# Altium schematic sheet headers.SchDoc
size A; SheetNumber: 2; SheetTotal: 3
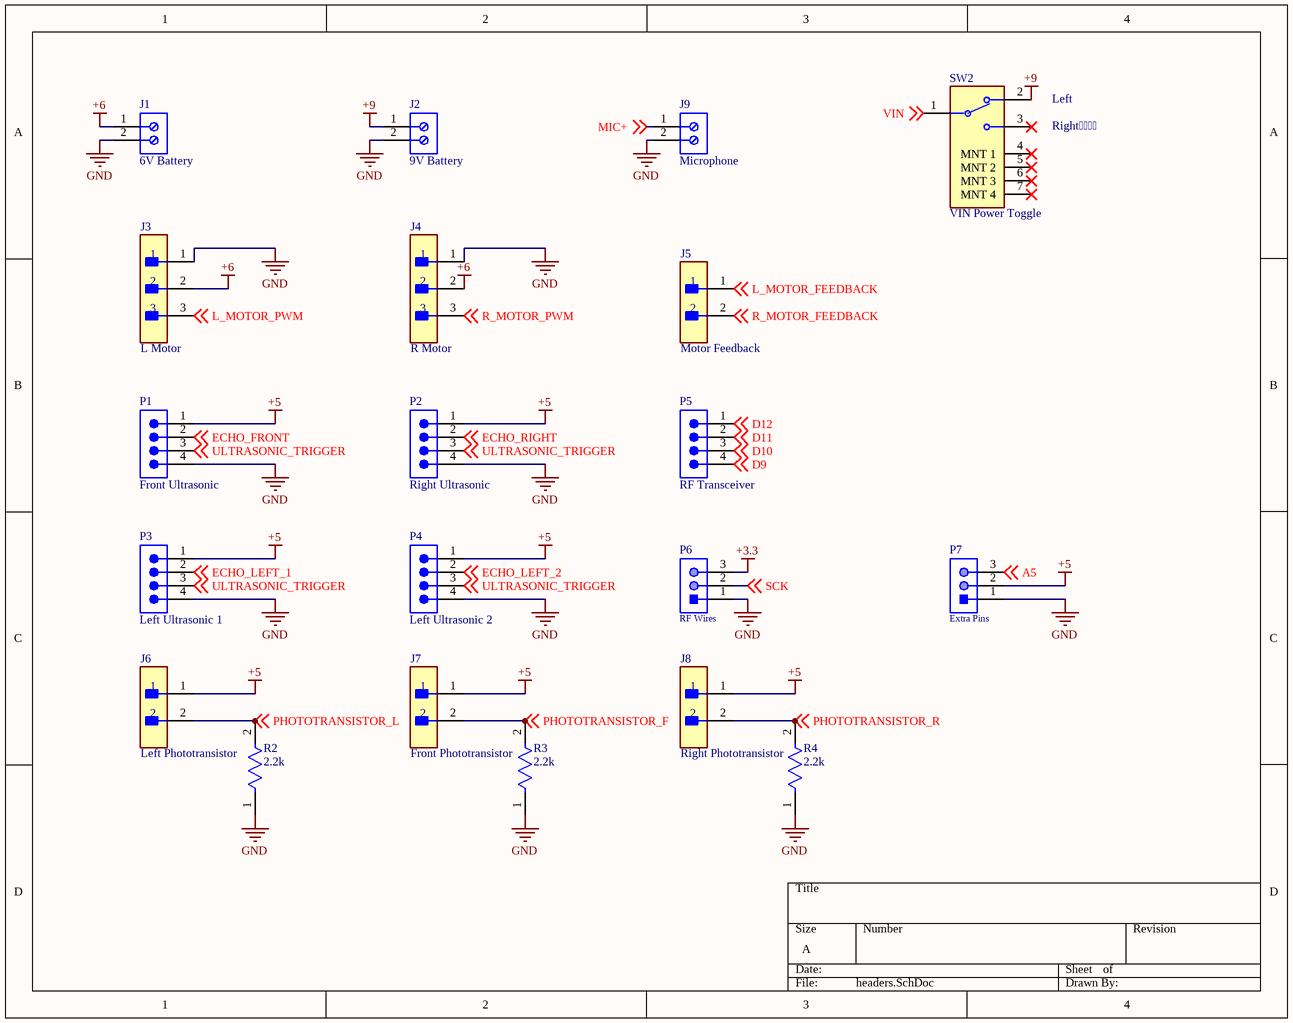
[diagram p0: headers.SchDoc]

## Parts
J1  6V Battery  [691103110002]
J2  9V Battery  [691103110002]
J3  L Motor  [FP-5-104935-3-MFG]
J4  R Motor  [FP-5-104935-3-MFG]
J5  Motor Feedback  [FP-M20-9990246-MFG]
J6  Left Phototransistor  [FP-M20-9990246-MFG]
J7  Front Phototransistor  [FP-M20-9990246-MFG]
J8  Right Phototransistor  [FP-M20-9990246-MFG]
J9  Microphone  [691103110002]
P1  Front Ultrasonic  [SMTC-TSW-104-08-X-S]
P2  Right Ultrasonic  [SMTC-TSW-104-08-X-S]
P3  Left Ultrasonic 1  [SMTC-TSW-104-08-X-S]
P4  Left Ultrasonic 2  [SMTC-TSW-104-08-X-S]
P5  RF Transceiver  [SMTC-TSW-104-08-X-S]
P6  RF Wires  [61300311121]
P7  Extra Pins  [61300311121]
R2  2.2k  [FP-CRCW0805-e3-IPC_B]
R3  2.2k  [FP-CRCW0805-e3-IPC_B]
R4  2.2k  [FP-CRCW0805-e3-IPC_B]
SW2  VIN Power Toggle  [FP-PCM12SMTR-MFG]

## Nets
+3.3: P6.3
+5: J6.1 J7.1 J8.1 P1.1 P2.1 P3.1 P4.1 P7.2
+6: J1.1 J3.2 J4.2
+9: J2.1 SW2.2
GND: J1.2 J2.2 J3.1 J4.1 J9.2 P1.4 P2.4 P3.4 P4.4 P6.1 P7.1 R2.1 R3.1 R4.1
A5: P7.3 ; off-sheet A5
D9: P5.4 ; off-sheet D9
D10: P5.3 ; off-sheet D10
D11: P5.2 ; off-sheet D11
D12: P5.1 ; off-sheet D12
ECHO_FRONT: P1.2 ; off-sheet ECHO_FRONT
ECHO_LEFT_1: P3.2 ; off-sheet ECHO_LEFT_1
ECHO_LEFT_2: P4.2 ; off-sheet ECHO_LEFT_2
ECHO_RIGHT: P2.2 ; off-sheet ECHO_RIGHT
L_MOTOR_FEEDBACK: J5.1 ; off-sheet L_MOTOR_FEEDBACK
L_MOTOR_PWM: J3.3 ; off-sheet L_MOTOR_PWM
MIC+: J9.1 ; off-sheet MIC+
PHOTOTRANSISTOR_F: J7.2 R3.2 ; off-sheet PHOTOTRANSISTOR_F
PHOTOTRANSISTOR_L: J6.2 R2.2 ; off-sheet PHOTOTRANSISTOR_L
PHOTOTRANSISTOR_R: J8.2 R4.2 ; off-sheet PHOTOTRANSISTOR_R
R_MOTOR_FEEDBACK: J5.2 ; off-sheet R_MOTOR_FEEDBACK
R_MOTOR_PWM: J4.3 ; off-sheet R_MOTOR_PWM
SCK: P6.2 ; off-sheet SCK
ULTRASONIC_TRIGGER: P1.3 P2.3 P3.3 P4.3 ; off-sheet ULTRASONIC_TRIGGER
VIN: SW2.1 ; off-sheet VIN

Not connected (* = marked no-connect by the designer): SW2 3* 4(MNT_1)* 5(MNT_2)* 6(MNT_3)* 7(MNT_4)*

## Notes on the sheet
- (near SW2) Left
- (near SW2) Right

## Library data of the parts
J1 J2 J9 = CMP-1502-03254-1: Series 1031 - 3.50 mm Horizontal Entry Modular with Pressure Clamp WR-TBL, 2 pin; Manufacturer: Wurth Elektronik; Pin Number: 2; Pitch: 3.50mm; Datasheet URL: http://katalog.we-online.de/em/datasheet/6911031100xx.pdf; Package Reference: 691103110002; Publisher: WurthElektronik; Manufacturer URL: http://www.we-online.de; Mounting Technology: THT; Operating Temperature: -40to105degC; Part Number: 691103110002; Packaging: Box; MPN: 691103110002
J3 J4 = CMP-03369-000121-1: CONN HEADER R/A 3POS 2.54MM; MPN: 5-104935-3; Gender: Male; Contact Retention: Yes (With); Number of Contacts: 3; Max Voltage Rating (AC): 30V; Approvals: CSA; PCB Mount Alignment: No (Without); Tail Length: 3.3mm; Row Spacing: 0.1inch; PCB Thickness: 0.062inch; Insulation Resistance: 5GR; Current Rating: 3A; PCB Mount Retention: Without; Contact Resistance: 15mR; PCB Mounting Orientation: Right Angle; Connector Type: Plug; Orientation: Right Angle; Termination: Crimp; Mating Retention: Yes (With); Housing Material: Thermoplastic; Contact Mating Length: 0.23inch; Contact Gender: Male; Number of Rows: 1; Contact Material: Brass; Packaging: Rail/Tube; Flammability Rating: UL94 V-0; Contact Plating: Gold; Radiation Hardening: No; Contact Current Rating: 3A; RoHS Compliant: Yes; Height: 13.59mm; ELV: Compliant; Mount: Through Hole; Color: Black; Contact Type: Male Pin; Length: 0.4inch; Mating Alignment: Yes (With); Strain Relief: No (Without); Pitch: 2.54mm; Backwall/Post Interruptions: No (Without); Housing Color: Black; Contact Shape: Square; Depth: 13.59mm; Min Operating Temperature: -65°C; Series: AMPMODU MTE; Max Operating Temperature: 105°C; Number of Positions: 3; Lead Free: Lead Free; Package Quantity: 52
J5 = CMP-15831-000009-1: CONN HEADER VERT 2POS 2.54MM; Manufacturer: Harwin; Manufacturer Part Number: M20-9990246; Conn Gender: Male; Conn Orientation: Vertical; Number Of Contacts: 2; Current Rating: 3A; ComponentLink2URL: https://cdn.harwin.com/pdfs/M20-999.pdf; ComponentLink2Description: Datasheet; Package: M20-9990246; Temperature: -40°C to +105°C; Octopart: https://octopart.com/m20-9990246-harwin-2590635; Mouser Description: 2.54mm (0.1") Pitch SIL Vertical PC Tail Pin Header, 6.1mm mating pin height, tin, 2 contacts; Temperature Range High: +105°C; Device Class L1: Connectors; RoHS: TRUE; Automotive: No; Height: 8.99mm; Number Of Rows: 1; Contact Material: Tin,Nickel; Category: Conn; Pitch: 2.54mm; Lead Free: Yes; Digikey Description: CONN HEADER VERT 2POS 2.54MM; Temperature Range Low: -40°C; Device Class L3: unset; Device Class L2: Headers and Wire Housings
J6-J8 = CMP-15831-000009-1: CONN HEADER VERT 2POS 2.54MM; Manufacturer: Harwin; Manufacturer Part Number: M20-9990246; Conn Gender: Male; Description: Connector Header Through Hole 2 position 0.100" (2.54mm); Conn Orientation: Vertical; Number Of Contacts: 2; Current Rating: 3A; ComponentLink2URL: https://cdn.harwin.com/pdfs/M20-999.pdf; ComponentLink2Description: Datasheet; Package: M20-9990246; Temperature: -40°C to +105°C; Octopart: https://octopart.com/m20-9990246-harwin-2590635; Mouser Description: 2.54mm (0.1") Pitch SIL Vertical PC Tail Pin Header, 6.1mm mating pin height, tin, 2 contacts; Temperature Range High: +105°C; Device Class L1: Connectors; RoHS: TRUE; Automotive: No; Height: 8.99mm; Number Of Rows: 1; Contact Material: Tin,Nickel; Category: Conn; Pitch: 2.54mm; Lead Free: Yes; Digikey Description: CONN HEADER VERT 2POS 2.54MM; Temperature Range Low: -40°C; Device Class L3: unset; Device Class L2: Headers and Wire Housings
P1-P5 = CMP-1024-00355-1: 0.025" SQ Post Header, Through-hole, Vertical, -55 to 125 degC, 2.54 mm Pitch, 4-Pin, Male, RoHS; Manufacturer: Samtec; PartNumber: TSW-104-08-F-S; Pitch: 2.54 mm; Temperature Range: -55 to 125 degC; ComponentLink3URL: http://www.samtec.com/documents/webfiles/cpdf/TSW-XXX-XX-XXX-X-XX-XXX-MKT.pdf; ComponentLink1Description: Manufacturer URL; PackageReference: TSW-104-08-X-S; DatasheetVersion: F-214; Mounting Technology: Through-hole; ComponentLink3Description: Package Specification; PackageVersion: DM, 8/1988; ComponentLink2Description: Datasheet; ComponentLink1URL: http://www.samtec.com; Orientation: Vertical; ComponentLink2URL: http://www.samtec.com/documents/webfiles/pdf/TSW_TH.PDF; RoHS: True; PackageDescription: .025[0.64] SQ. Post Terminal Strip Assembly
P6 P7 = CMP-1502-01062-1: THT Vertical Pin Header WR-PHD, Pitch 2.54 mm, Single Row, 3 pins; Manufacturer: Wurth Elektronik; Withstanding Voltage: 500VAC; Working Voltage: 250VAC; Rated Current: 3A; Pitch: 2.54mm; Pin Number: 3; Gender: Male; Contact Resistance: 20mOhm; Package Reference: 61300311121; Manufacturer URL: http://www.we-online.de; Datasheet URL: https://katalog.we-online.de/em/datasheet/6130xx11121.pdf; Operating Temperature: -40to105degC; Part Number: 61300311121; Orientation: Vertical; Packaging: Bag; Row Number: Single; Mounting Technology: THT; Publisher: WurthElektronik
R2-R4 = CMP-2001-03760-2: RES Thick Film, 2.2kΩ, 1%, 0.125W, 100ppm/°C, 0805; MPN: CRCW08052K20FKEA; Voltage Rating (DC): 150V; Max Power Dissipation: 125mW; Resistance: 2.2kR; Case/Package: 0805; Width: 1.25mm; Voltage Rating: 150V; Composition: Thick Film; Power Rating: 125mW; Packaging: Tape and Reel; Min Operating Temperature: -55°C; Contact Plating: Tin; Tolerance: 1%; Military Standard: Not; Case Code (Metric): 2012; Radiation Hardening: No; Termination: SMD/SMT; Lead Free: Lead Free; Case Code (Imperial): 0805; Max Operating Temperature: 155°C; Depth: 1.25mm; Weight: 0.000194oz; Number of Terminations: 2; Length: 2mm; Package Quantity: 10; Temperature Coefficient: 100ppm/°C; Features: Automotive AEC-Q200; Height: 0.45mm
SW2 = CMP-2000-06884-2: SWITCH SLIDE SPDT 300MA 6V; MPN: PCM12SMTR; Actuator Material: Nylon; Switch Function: On-On; Insulation Resistance: 100mR; Actuator Type: Standard; Mechanical Life: 10000Cycles; Actuator Length: 1.5mm; Contact Resistance: 70mR; Min Operating Temperature: -20°C; Max Current Rating: 300mA; Max Voltage Rating (DC): 6V; Package Quantity: 1; Mount: Surface Mount; Packaging: Tape and Reel; Contact Plating: Silver; Depth: 5mm; REACH SVHC: No SVHC; Voltage Rating (DC): 6V; Voltage Rating (AC): 6V; Max Operating Temperature: 85°C; Length: 7.7mm; Termination: Gull Wing; Current Rating: 300mA; Contact Current Rating: 300mA; Orientation: Right Angle; Width: 6.7mm; Switch Travel: 1.5mm; Lead Free: Lead Free; Contact Material: Copper Alloy; Throw Configuration: SPDT